# Altium schematic sheet CAM_CONNECTOR.SchDoc
size 420 x 297 mm; SheetNumber: 5; SheetTotal: 7
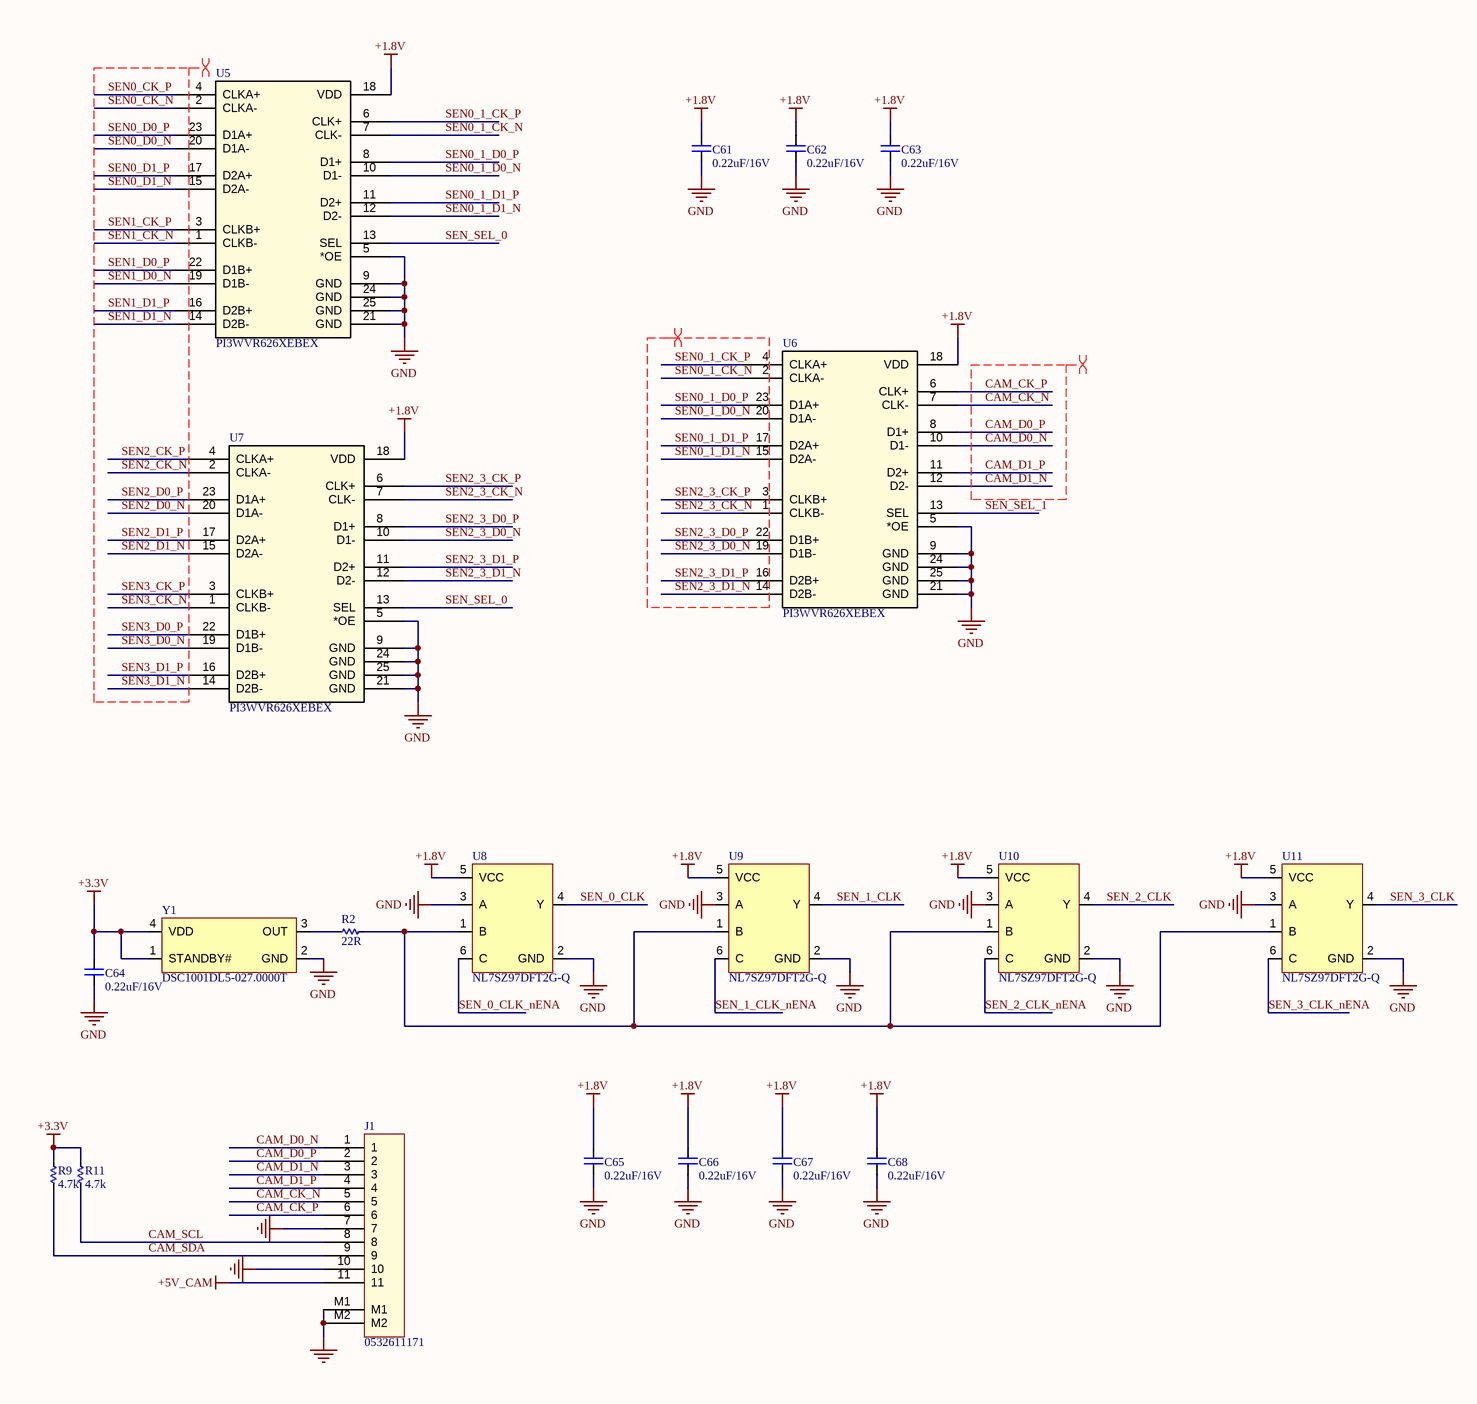
[diagram p0: CAM_CONNECTOR.SchDoc]

## Parts
C61  0.22uF/16V  [CAP_C_1005X60]
C62  0.22uF/16V  [CAP_C_1005X60]
C63  0.22uF/16V  [CAP_C_1005X60]
C64  0.22uF/16V  [CAP_C_1005X60]
C65  0.22uF/16V  [CAP_C_1005X60]
C66  0.22uF/16V  [CAP_C_1005X60]
C67  0.22uF/16V  [CAP_C_1005X60]
C68  0.22uF/16V  [CAP_C_1005X60]
J1  0532611171  [MOLEX_0532611171]
R2  22R  [RES_C_1005X40]
R9  4.7k  [RES_C_1005X40]
R11  4.7k  [RES_C_1005X40]
U5  PI3WVR626XEBEX  [PI3WVR626XEBEX_DIO_2]
U6  PI3WVR626XEBEX  [PI3WVR626XEBEX_DIO_2]
U7  PI3WVR626XEBEX  [PI3WVR626XEBEX_DIO_2]
U8  NL7SZ97DFT2G-Q  [SC-88]
U9  NL7SZ97DFT2G-Q  [SC-88]
U10  NL7SZ97DFT2G-Q  [SC-88]
U11  NL7SZ97DFT2G-Q  [SC-88]
Y1  DSC1001DL5-027.0000T  [OSCDFN250X200X89-4N]

## Nets
+1.8V: C61.2 C62.2 C63.2 C65.2 C66.2 C67.2 C68.2 U5.18(VDD) U6.18(VDD) U7.18(VDD) U8.5(VCC) U9.5(VCC) U10.5(VCC) U11.5(VCC)
+3.3V: C64.2 R9.1 R11.1 Y1.1(STANDBY#) Y1.4(VDD)
+5V_CAM: J1.11
GND: C61.1 C62.1 C63.1 C64.1 C65.1 C66.1 C67.1 C68.1 J1.7 J1.10 J1.M1 J1.M2 U5.5(*OE) U5.9(GND) U5.21(GND) U5.24(GND) U5.25(GND) U6.5(*OE) U6.9(GND) U6.21(GND) U6.24(GND) U6.25(GND) U7.5(*OE) U7.9(GND) U7.21(GND) U7.24(GND) U7.25(GND) U8.2(GND) U8.3(A) U9.2(GND) U9.3(A) U10.2(GND) U10.3(A) U11.2(GND) U11.3(A) Y1.2(GND)
CAM_CK_N: J1.5 U6.7(CLK-)
CAM_CK_P: J1.6 U6.6(CLK+)
CAM_D0_N: J1.1 U6.10(D1-)
CAM_D0_P: J1.2 U6.8(D1+)
CAM_D1_N: J1.3 U6.12(D2-)
CAM_D1_P: J1.4 U6.11(D2+)
CAM_SCL: J1.8 R11.2
CAM_SDA: J1.9 R9.2
SEN0_1_CK_N: U5.7(CLK-) U6.2(CLKA-)
SEN0_1_CK_P: U5.6(CLK+) U6.4(CLKA+)
SEN0_1_D0_N: U5.10(D1-) U6.20(D1A-)
SEN0_1_D0_P: U5.8(D1+) U6.23(D1A+)
SEN0_1_D1_N: U5.12(D2-) U6.15(D2A-)
SEN0_1_D1_P: U5.11(D2+) U6.17(D2A+)
SEN0_CK_N: U5.2(CLKA-)
SEN0_CK_P: U5.4(CLKA+)
SEN0_D0_N: U5.20(D1A-)
SEN0_D0_P: U5.23(D1A+)
SEN0_D1_N: U5.15(D2A-)
SEN0_D1_P: U5.17(D2A+)
SEN1_CK_N: U5.1(CLKB-)
SEN1_CK_P: U5.3(CLKB+)
SEN1_D0_N: U5.19(D1B-)
SEN1_D0_P: U5.22(D1B+)
SEN1_D1_N: U5.14(D2B-)
SEN1_D1_P: U5.16(D2B+)
SEN2_3_CK_N: U6.1(CLKB-) U7.7(CLK-)
SEN2_3_CK_P: U6.3(CLKB+) U7.6(CLK+)
SEN2_3_D0_N: U6.19(D1B-) U7.10(D1-)
SEN2_3_D0_P: U6.22(D1B+) U7.8(D1+)
SEN2_3_D1_N: U6.14(D2B-) U7.12(D2-)
SEN2_3_D1_P: U6.16(D2B+) U7.11(D2+)
SEN2_CK_N: U7.2(CLKA-)
SEN2_CK_P: U7.4(CLKA+)
SEN2_D0_N: U7.20(D1A-)
SEN2_D0_P: U7.23(D1A+)
SEN2_D1_N: U7.15(D2A-)
SEN2_D1_P: U7.17(D2A+)
SEN3_CK_N: U7.1(CLKB-)
SEN3_CK_P: U7.3(CLKB+)
SEN3_D0_N: U7.19(D1B-)
SEN3_D0_P: U7.22(D1B+)
SEN3_D1_N: U7.14(D2B-)
SEN3_D1_P: U7.16(D2B+)
SEN_0_CLK: U8.4(Y)
SEN_0_CLK_nENA: U8.6(C)
SEN_1_CLK: U9.4(Y)
SEN_1_CLK_nENA: U9.6(C)
SEN_2_CLK: U10.4(Y)
SEN_2_CLK_nENA: U10.6(C)
SEN_3_CLK: U11.4(Y)
SEN_3_CLK_nENA: U11.6(C)
SEN_SEL_0: U5.13(SEL) U7.13(SEL)
SEN_SEL_1: U6.13(SEL)
NetR2_1: R2.1 U8.1(B) U9.1(B) U10.1(B) U11.1(B)
NetR2_2: R2.2 Y1.3(OUT)

## Layout directives
differential pair; net class DIFF100; differential pair class DIFF100: CAM_CK_N, CAM_CK_P, CAM_D0_N, CAM_D0_P, CAM_D1_N, CAM_D1_P, SEN0_1_CK_N, SEN0_1_CK_P, SEN0_1_D0_N, SEN0_1_D0_P, SEN0_1_D1_N, SEN0_1_D1_P, SEN0_CK_N, SEN0_CK_P, SEN0_D0_N, SEN0_D0_P, SEN0_D1_N, SEN0_D1_P, SEN1_CK_N, SEN1_CK_P, SEN1_D0_N, SEN1_D0_P, SEN1_D1_N, SEN1_D1_P, SEN2_3_CK_N, SEN2_3_CK_P, SEN2_3_D0_N, SEN2_3_D0_P, SEN2_3_D1_N, SEN2_3_D1_P, SEN2_CK_N, SEN2_CK_P, SEN2_D0_N, SEN2_D0_P, SEN2_D1_N, SEN2_D1_P, SEN3_CK_N, SEN3_CK_P, SEN3_D0_N, SEN3_D0_P, SEN3_D1_N, SEN3_D1_P

## Notes on the sheet
- Project:
- Sub-system:
- Design by:
- Sheet title:
- Sheet
- of
- Checked by:
- Approved by:
- Revision:
- Document No:
- Size:
- Date:
- A3

## Library data of the parts
C61-C68 = CAP_SMD: CAP_Chip; Value: 33pF
J1 = Header 11x1_2M
R2 = RES-SMD: RES-Chip; Manufacturer: Generic Components; Class: Passive; Published: 08/06/2000; Publisher: Altium Hobart Technology Centre
R9 R11 = _RES_B_2: RES
U5-U7 = PI3WVR626XEBEX: Mfr_Name: Diodes Inc; RefDes: RefDes; Type: Type
U8-U11 = IC_FLEXLOGIC_NL7SZ97DFT2G-Q
Y1 = Y_OSC27MHz_DSC1001DL5-027.0000T